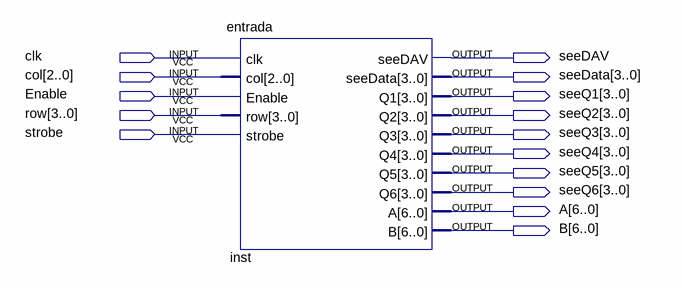
[diagram p0: schematic sheet]
// Quartus schematic testEntrada.bdf as structural Verilog: 1 symbols, 15 pins
module testEntrada (
  input  clk,
  input  [2:0] col,
  input  Enable,
  input  [3:0] row,
  input  strobe,
  output seeDAV,
  output [3:0] seeData,
  output [3:0] seeQ1,
  output [3:0] seeQ2,
  output [3:0] seeQ3,
  output [3:0] seeQ4,
  output [3:0] seeQ5,
  output [3:0] seeQ6,
  output [6:0] A,
  output [6:0] B
);

  entrada inst (
    .clk(clk), .col(col), .Enable(Enable), .row(row), .strobe(strobe), .seeDAV(seeDAV), .seeData(seeData),
    .Q1(seeQ1), .Q2(seeQ2), .Q3(seeQ3), .Q4(seeQ4), .Q5(seeQ5), .Q6(seeQ6), .A(A), .B(B));
endmodule
